# Altium schematic sheet Shutdown_Nodes.SchDoc
size Tabloid; SheetNumber: 8; SheetTotal: 13
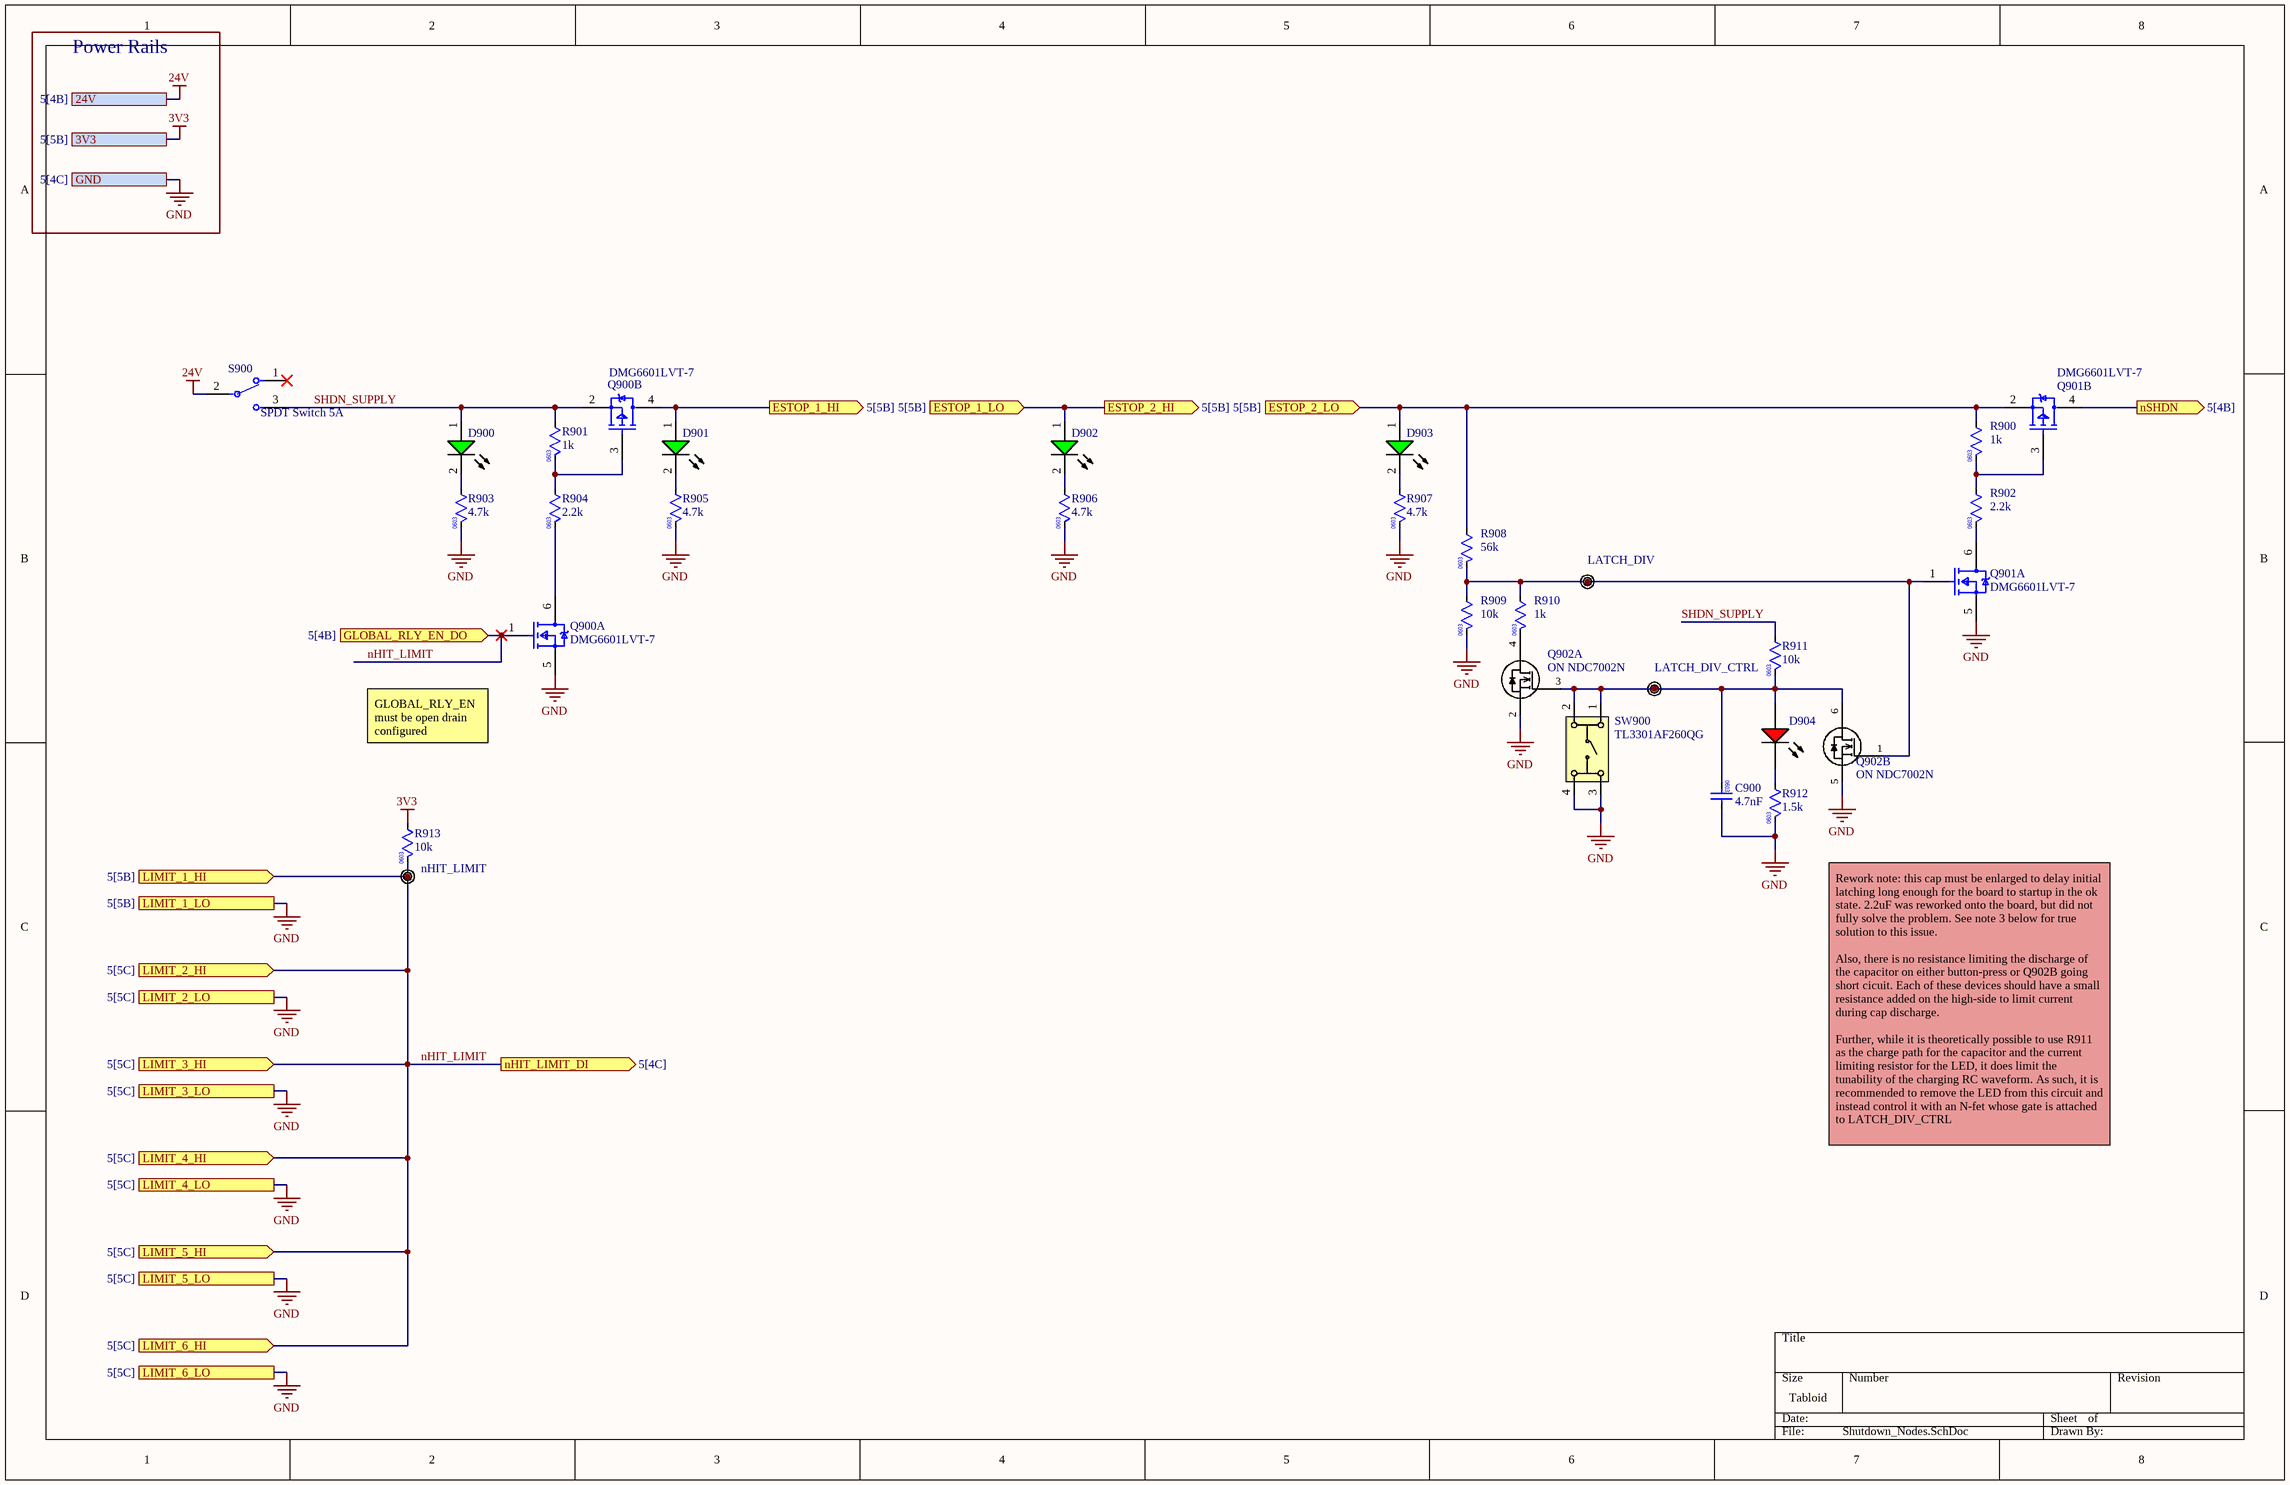
[diagram p0: Shutdown_Nodes.SchDoc]

## Parts
C900  value 4.7nF  [0603 Capacitor Footprint]  (hidden comment: 0603 4.7nF 10% 50V)
D900  Lite-On LTST-C193KGKT-5A  [Lite-On LTST-C193KGKT-5A GREEN (1608)]  (value not drawn)
D901  Lite-On LTST-C193KGKT-5A  [Lite-On LTST-C193KGKT-5A GREEN (1608)]  (value not drawn)
D902  Lite-On LTST-C193KGKT-5A  [Lite-On LTST-C193KGKT-5A GREEN (1608)]  (value not drawn)
D903  Lite-On LTST-C193KGKT-5A  [Lite-On LTST-C193KGKT-5A GREEN (1608)]  (value not drawn)
D904  LTST-C190KRKT  [LTST-C191KRKT_V]  (value not drawn)
Q900  DMG6601LVT-7  [FP-TSOT26-IPC_A]  (parts A,B of 2)
Q901  DMG6601LVT-7  [FP-TSOT26-IPC_A]  (parts A,B of 2)
Q902  ON NDC7002N  [SOT-6]  (parts A,B of 2)
R900  value 1k  [0603 Resistor Footprint]  (hidden comment: 0603 1k 1% 0.33W)
R901  value 1k  [0603 Resistor Footprint]  (hidden comment: 0603 1k 1% 0.33W)
R902  value 2.2k  [0603 Resistor Footprint]  (hidden comment: 0603 2k2 1% 0.25W)
R903  value 4.7k  [0603 Resistor Footprint]  (hidden comment: 0603 4k7 1% 0.33W)
R904  value 2.2k  [0603 Resistor Footprint]  (hidden comment: 0603 2k2 1% 0.25W)
R905  value 4.7k  [0603 Resistor Footprint]  (hidden comment: 0603 4k7 1% 0.33W)
R906  value 4.7k  [0603 Resistor Footprint]  (hidden comment: 0603 4k7 1% 0.33W)
R907  value 4.7k  [0603 Resistor Footprint]  (hidden comment: 0603 4k7 1% 0.33W)
R908  value 56k  [0603 Resistor Footprint]  (hidden comment: 0603 56k 1% 0.33W)
R909  value 10k  [0603 Resistor Footprint]  (hidden comment: 0603 10k 1% 0.3W)
R910  value 1k  [0603 Resistor Footprint]  (hidden comment: 0603 1k 1% 0.33W)
R911  value 10k  [0603 Resistor Footprint]  (hidden comment: 0603 10k 1% 0.3W)
R912  value 1.5k  [0603 Resistor Footprint]  (hidden comment: 0603 1k5 5% 0.25W)
R913  value 10k  [0603 Resistor Footprint]  (hidden comment: 0603 10k 1% 0.3W)
S900  SPDT Switch 5A  [SPDT 5A]
SW900  TL3301AF260QG  [MCU Reset Switch]
TP900  LATCH_DIV  [TESTPOINT]  (no BOM)
TP901  LATCH_DIV_CTRL  [TESTPOINT]  (no BOM)
TP902  nHIT_LIMIT  [TESTPOINT]  (no BOM)

## Ports
3V3 (see 5[5B]), 24V (see 5[4B]), ESTOP_1_HI (out, see 5[5B]), ESTOP_1_LO (in, see 5[5B]), ESTOP_2_HI (out, see 5[5B]), ESTOP_2_LO (in, see 5[5B]), GLOBAL_RLY_EN_DO (in, see 5[4B]), GND (see 5[4C]), LIMIT_1_HI (in, see 5[5B]), LIMIT_1_LO (see 5[5B]), LIMIT_2_HI (in, see 5[5C]), LIMIT_2_LO (see 5[5C]), LIMIT_3_HI (in, see 5[5C]), LIMIT_3_LO (see 5[5C]), LIMIT_4_HI (in, see 5[5C]), LIMIT_4_LO (see 5[5C]), LIMIT_5_HI (in, see 5[5C]), LIMIT_5_LO (see 5[5C]), LIMIT_6_HI (in, see 5[5C]), LIMIT_6_LO (see 5[5C]), nHIT_LIMIT_DI (out, see 5[4C]), nSHDN (out, see 5[4B])

## Nets
3V3: R913.1 ; port 3V3
24V: S900.2 ; port 24V
GND: C900.1 Q900.5(S1) Q901.5(S1) Q902.2(SOURCE1) Q902.5(SOURCE2) R903.2 R905.2 R906.2 R907.2 R909.2 R912.2 SW900.3 SW900.4 ; port LIMIT_1_LO, port LIMIT_2_LO, port LIMIT_3_LO, port LIMIT_4_LO, port LIMIT_5_LO, port LIMIT_6_LO, port GND
ESTOP_1_HI: D901.1(A) Q900.4(D2) ; port ESTOP_1_HI
ESTOP_1_LO: D902.1(A) ; port ESTOP_1_LO, port ESTOP_2_HI
ESTOP_2_LO: D903.1(A) Q901.2(S2) R900.1 R908.1 ; port ESTOP_2_LO
nHIT_LIMIT: Q900.1(G1) R913.2 TP902.1(TP) ; port GLOBAL_RLY_EN_DO, port LIMIT_1_HI, port LIMIT_2_HI, port LIMIT_3_HI, port LIMIT_4_HI, port LIMIT_5_HI, port LIMIT_6_HI, port nHIT_LIMIT_DI
nSHDN: Q901.4(D2) ; port nSHDN
SHDN_SUPPLY: D900.1(A) Q900.2(S2) R901.1 R911.1 S900.3
NetC900_2: C900.2 D904.1(A) Q902.3(GATE1) Q902.6(DRAIN2) R911.2 SW900.1 SW900.2 TP901.1(TP)
NetD900_2: D900.2(K) R903.1
NetD901_2: D901.2(K) R905.1
NetD902_2: D902.2(K) R906.1
NetD903_2: D903.2(K) R907.1
NetD904_2: D904.2(K) R912.1
NetQ900_3: Q900.3(G2) R901.2 R904.1
NetQ900_6: Q900.6(D1) R904.2
NetQ901_1: Q901.1(G1) Q902.1(GATE2) R908.2 R909.1 R910.1 TP900.1(TP)
NetQ901_3: Q901.3(G2) R900.2 R902.1
NetQ901_6: Q901.6(D1) R902.2
NetQ902_4: Q902.4(DRAIN1) R910.2

Not connected (* = marked no-connect by the designer): S900 1*

## Notes on the sheet
- Power Rails
- GLOBAL_RLY_EN must be open drain configured
- Rework note: this cap must be enlarged to delay initial latching long enough for the board to startup in the ok state. 2.2uF was reworked onto the board, but did not fully solve the problem. See note 3 below for true solution to this issue.
  Also, there is no resistance limiting the discharge of the capacitor on either button-press or Q902B going short cicuit. Each of these devices should have a small resistance added on the high-side to limit current during cap discharge.
  Further, while it is theoretically possible to use R911 as the charge path for the capacitor and the current limiting resistor for the LED, it does limit the tunability of the charging RC waveform. As such, it is recommended to remove the LED from this circuit and instead control it with an N-fet whose gate is attached to LATCH_DIV_CTRL
- (in symbol CMP-009-00190-8) 0603

## Library data of the parts
C900 = CMP-001-00087-1: Ceramic Capacitor, Multilayer, Ceramic, 50V, 10% Tol, X7R, 15% TC, 0.0047uF, Surface Mount, 0603; Max Operating Temperature: 125°C; Case/Package: 0603; Capacitor Type: Ceramic; Min Operating Temperature: -55°C; Tolerance: 10%; Supplier Part Number 1: 13-CC0603KPX7R9BB101CT-ND; RoHS Compliant: Yes; Temperature Characteristics Code: X7R; Mounting Technology: Surface Mount; Source: UBC Formula Electric.SchLib; Voltage Rating: 50V; Pins: 2
D900-D903 = CMP-026-000009-1: LED GREEN CLEAR CHIP SMD; Source: UBC Formula Electric.SchLib; Supplier 1: Digi-Key; Supplier Part Number 1: 160-1828-1-ND; Design Item ID: Lite-On LTST-C193KGKT-5A
D904 = CMP-007-00024-1: LED Uni-Color Red, 62.5 mW, 25 mA, -30 to 85 degC, 2-Pin SMD, RoHS, Tape and Reel; Manufacturer: Lite-On; Luminous Intensity: 54mcd; Nominal Vf: 2V; Power: 75mW; Viewing Angle: 130degrees; Lens Style: Diffused; Forward Current: 20mA; Datasheet URL: http://optoelectronics.liteon.com/upload/download/DS-22-99-0151/S_110_LTST-C190KRKT.pdf; Pins: 2; Package Quantity: 3000; RoHS Compliant: True; Packaging: TapeandReel; Package Reference: C191KRKT; Colour: Red; Case/Package: 0603; Package Description: 2-Pin Surface Mount Device, Body 1.6 x 0.8 mm; Min Operating Temperature: -55°C; Forward Voltage: 2V; Illumination Colour: Red; Manufacturer URL: http://www.us.liteon.com/; Mounting Technology: SM; Datasheet Version: Rev. F, 05/2013; Max Operating Temperature: 85°C
Q900 Q901 = CMP-013-00034-1: Small Signal Field-Effect Transistor, 3.8A I(D), 30V, 2-Element, N-Channel and P-Channel, Silicon, Metal-oxide Semiconductor FET; RoHS Compliant: Yes; Pins: 6
Q902 = CMP-016-000001-4: MOSFET 2N-CH 50V 0.51A SSOT6; Manufacturer: ON Semiconductor / Fairchild; Rise Time: 6ns; Current Rating: 350mA; On-State Resistance: 2R; Power Dissipation: 960mW; FET Type: 2 N-Channel; Input Capacitance: 20pF; Continuous Drain Current (ID): 510mA; Number of Elements: 2; Element Configuration: Dual; Gate to Source Voltage (Vgs): 20V; Max Power Dissipation: 700mW; Nominal Vgs: 1.9V; Turn-Off Delay Time: 11ns; ComponentLink15Description: https://datasheet.ciiva.com/8114/ndc7002n-8114748.pdf?src-supplier=Avnet; ComponentLink1URL: https://datasheet.ciiva.com/927/ndc7002n-927936.pdf?src-supplier=Digi-Key; ComponentLink9URL: https://datasheet.ciiva.com/17062/ndc7002n-17062122.pdf?src-supplier=Future+Electronics; Category: MOSFETs; ComponentLink5URL: https://datasheet.ciiva.com/26788/ndc7002n-26788993.pdf?src-supplier=IIIC; Contact Plating: Tin,Matte; ComponentLink10URL: https://datasheet.ciiva.com/22681/276179-22681804.pdf?src-supplier=Element14; ComponentLink16Description: https://datasheet.ciiva.com/48701/001264957-da-01-en-mosfet-2n-ch-50v-5-ndc7002n-sot-23-6-fsc-48701131.pdf?src-supplier=Conrad; ComponentLink9Description: https://datasheet.ciiva.com/17062/ndc7002n-17062122.pdf?src-supplier=Future+Electronics; Lead Free: Lead Free; ComponentLink13Description: https://datasheet.ciiva.com/28548/276179-28548207.pdf?src-supplier=Element14; ComponentLink12Description: https://datasheet.ciiva.com/22681/276179-22681805.pdf?src-supplier=Element14; ComponentLink3URL: https://datasheet.ciiva.com/4441/ndc7002n-97690-4441778.pdf?src-supplier=Mouser; Case/Package: SOT-23-6; ComponentLink14URL: https://datasheet.ciiva.com/15137/getdatasheetpartid-81737-15137541.pdf?src-supplier=Verical; Packaging: Tape and Reel; ComponentLink7Description: https://datasheet.ciiva.com/927/ndc7002n-927938.pdf?src-supplier=Digi-Key; Max Operating Temperature: 150°C; Turn-On Delay Time: 6ns; Design Item ID: ON NDC7002N; RoHS Compliant: Yes; Number of Pins: 6; ComponentLink4URL: https://datasheet.ciiva.com/34301/1030156-34301891.pdf?src-supplier=Jameco; ComponentLink14Description: https://datasheet.ciiva.com/15137/getdatasheetpartid-81737-15137541.pdf?src-supplier=Verical; Package Quantity: 1; ComponentLink6Description: https://datasheet.ciiva.com/927/ndc7002n-927937.pdf?src-supplier=Digi-Key; Supplier Part Number 1: NDC7002NCT-ND; RoHS: Yes; Rds On Max: 2R; Fall Time: 6ns; ComponentLink1Description: https://datasheet.ciiva.com/927/ndc7002n-927936.pdf?src-supplier=Digi-Key; ComponentLink13URL: https://datasheet.ciiva.com/28548/276179-28548207.pdf?src-supplier=Element14; Stock 1: 634459; ComponentLink16URL: https://datasheet.ciiva.com/48701/001264957-da-01-en-mosfet-2n-ch-50v-5-ndc7002n-sot-23-6-fsc-48701131.pdf?src-supplier=Conrad; Supplier 1: Digi-Key; ComponentLink8Description: https://datasheet.ciiva.com/26252/ndc7002n-26252213.pdf?src-supplier=Avnet+Europe; Source: UBC Formula Electric.SchLib; Weight: 0.036g; ComponentLink15URL: https://datasheet.ciiva.com/8114/ndc7002n-8114748.pdf?src-supplier=Avnet; ComponentLink11URL: https://datasheet.ciiva.com/46382/276179-46382956.pdf?src-supplier=Element14; Voltage Rating (DC): 50V; Dual Supply Voltage: 50V; Drain to Source Breakdown Voltage: 50V; ComponentLink6URL: https://datasheet.ciiva.com/927/ndc7002n-927937.pdf?src-supplier=Digi-Key; Drain to Source Voltage (Vdss): 50V; ComponentLink8URL: https://datasheet.ciiva.com/26252/ndc7002n-26252213.pdf?src-supplier=Avnet+Europe; Height: 1mm; Min Operating Temperature: -55°C; REACH SVHC: No SVHC; ComponentLink2Description: https://datasheet.ciiva.com/6039/276179-6039921.pdf?src-supplier=Farnell; ComponentLink4Description: https://datasheet.ciiva.com/34301/1030156-34301891.pdf?src-supplier=Jameco; Mount: Surface Mount; Radiation Hardening: No; Length: 3mm; Width: 1.7mm; Drain to Source Resistance: 2R; ComponentLink3Description: https://datasheet.ciiva.com/4441/ndc7002n-97690-4441778.pdf?src-supplier=Mouser; Manufacturer Part Number: NDC7002N; ComponentLink10Description: https://datasheet.ciiva.com/22681/276179-22681804.pdf?src-supplier=Element14; ComponentLink5Description: https://datasheet.ciiva.com/26788/ndc7002n-26788993.pdf?src-supplier=IIIC; ComponentLink2URL: https://datasheet.ciiva.com/6039/276179-6039921.pdf?src-supplier=Farnell; Pricing 1: 1=0.47000, 10=0.36400, 25=0.34800, 100=0.21860, 500=0.20240, 1000=0.13763 (USD); ComponentLink12URL: https://datasheet.ciiva.com/22681/276179-22681805.pdf?src-supplier=Element14; Threshold Voltage: 1.9V; ComponentLink7URL: https://datasheet.ciiva.com/927/ndc7002n-927938.pdf?src-supplier=Digi-Key; ComponentLink11Description: https://datasheet.ciiva.com/46382/276179-46382956.pdf?src-supplier=Element14
R900 R901 R910 = CMP-009-00184-7: RES SMD 1K OHM 1% 1/3W 0603; Manufacturer Part Number: CRCW06031K00FKEAHP; Power: 250mW; Max Operating Temperature: 155°C; RoHS Compliant: Yes; Pins: 2; Case/Package: 0603; Tolerance: 1%; Mounting Technology: Surface Mount; Min Operating Temperature: -55°C; Digikey Part Number: 541-1.00KSCT-ND
R902 R904 = CMP-009-00190-8: RES SMD 2.2K OHM 1% 1/4W 0603; Manufacturer Part Number: RCS06032K20FKEA; Digikey Part Number: 541-10449-1-ND
R903 R905-R907 = CMP-009-00182-7: RES SMD 4.7K OHM 1% 1/3W 0603; Manufacturer Part Number: CRCW06034K70FKEAHP; Power: 250mW; Tolerance: 1%; Case/Package: 0603; Pins: 2; RoHS Compliant: Yes; Min Operating Temperature: -55°C; Mounting Technology: Surface Mount; Digikey Part Number: 541-4.70KSCT-ND; Max Operating Temperature: 155°C
R908 = CMP-009-00197-3: RES SMD 56K OHM 1% 1/3W 0603; Power: 333mW; Mounting Technology: Surface Mount; Tolerance: 1%; Case/Package: 0603; RoHS Compliant: Yes; Min Operating Temperature: -55°C; Pins: 2; Max Operating Temperature: 155°C
R909 R911 R913 = CMP-009-00181-10: RES SMD 10K OHM 1% 1/3W 0603; Manufacturer Part Number: CRCW060310K0FKEAHP; Power: 333mW; Case/Package: 0603; Max Operating Temperature: 155°C; Min Operating Temperature: -55°C; Pins: 2; Digikey Part Number: 541-10.0KSCT-ND; RoHS Compliant: Yes; Tolerance: 1%; Mounting Technology: Surface Mount
R912 = CMP-009-00198-1: Res Thick Film 0603 1.5K Ohm 5% 0.25W(1/4W) ±200ppm/C Pad SMD Automotive T/R; Manufacturer Part Number: ERJ-PA3J152V; Power: 250mW; Case/Package: 0603; Min Operating Temperature: -55°C; Pins: 2; Max Operating Temperature: 155°C; Tolerance: 5%; Digikey Part Number: P1.5KBZCT-ND; RoHS Compliant: Yes; Mounting Technology: Surface Mount
SW900 = CMP-027-000004-1: SWITCH TACTILE SPST-NO 0.05A 12V; Design Item ID: E-Switch TL3301AF260QG; Supplier Part Number 1: EG2527CT-ND; Supplier 1: Digi-Key; Source: UBC Formula Electric.SchLib
TP900-TP902 = CMP-020-0000-4: Source: UBC Formula Electric.SchLib; Design Item ID: Thru-Hole Test Point